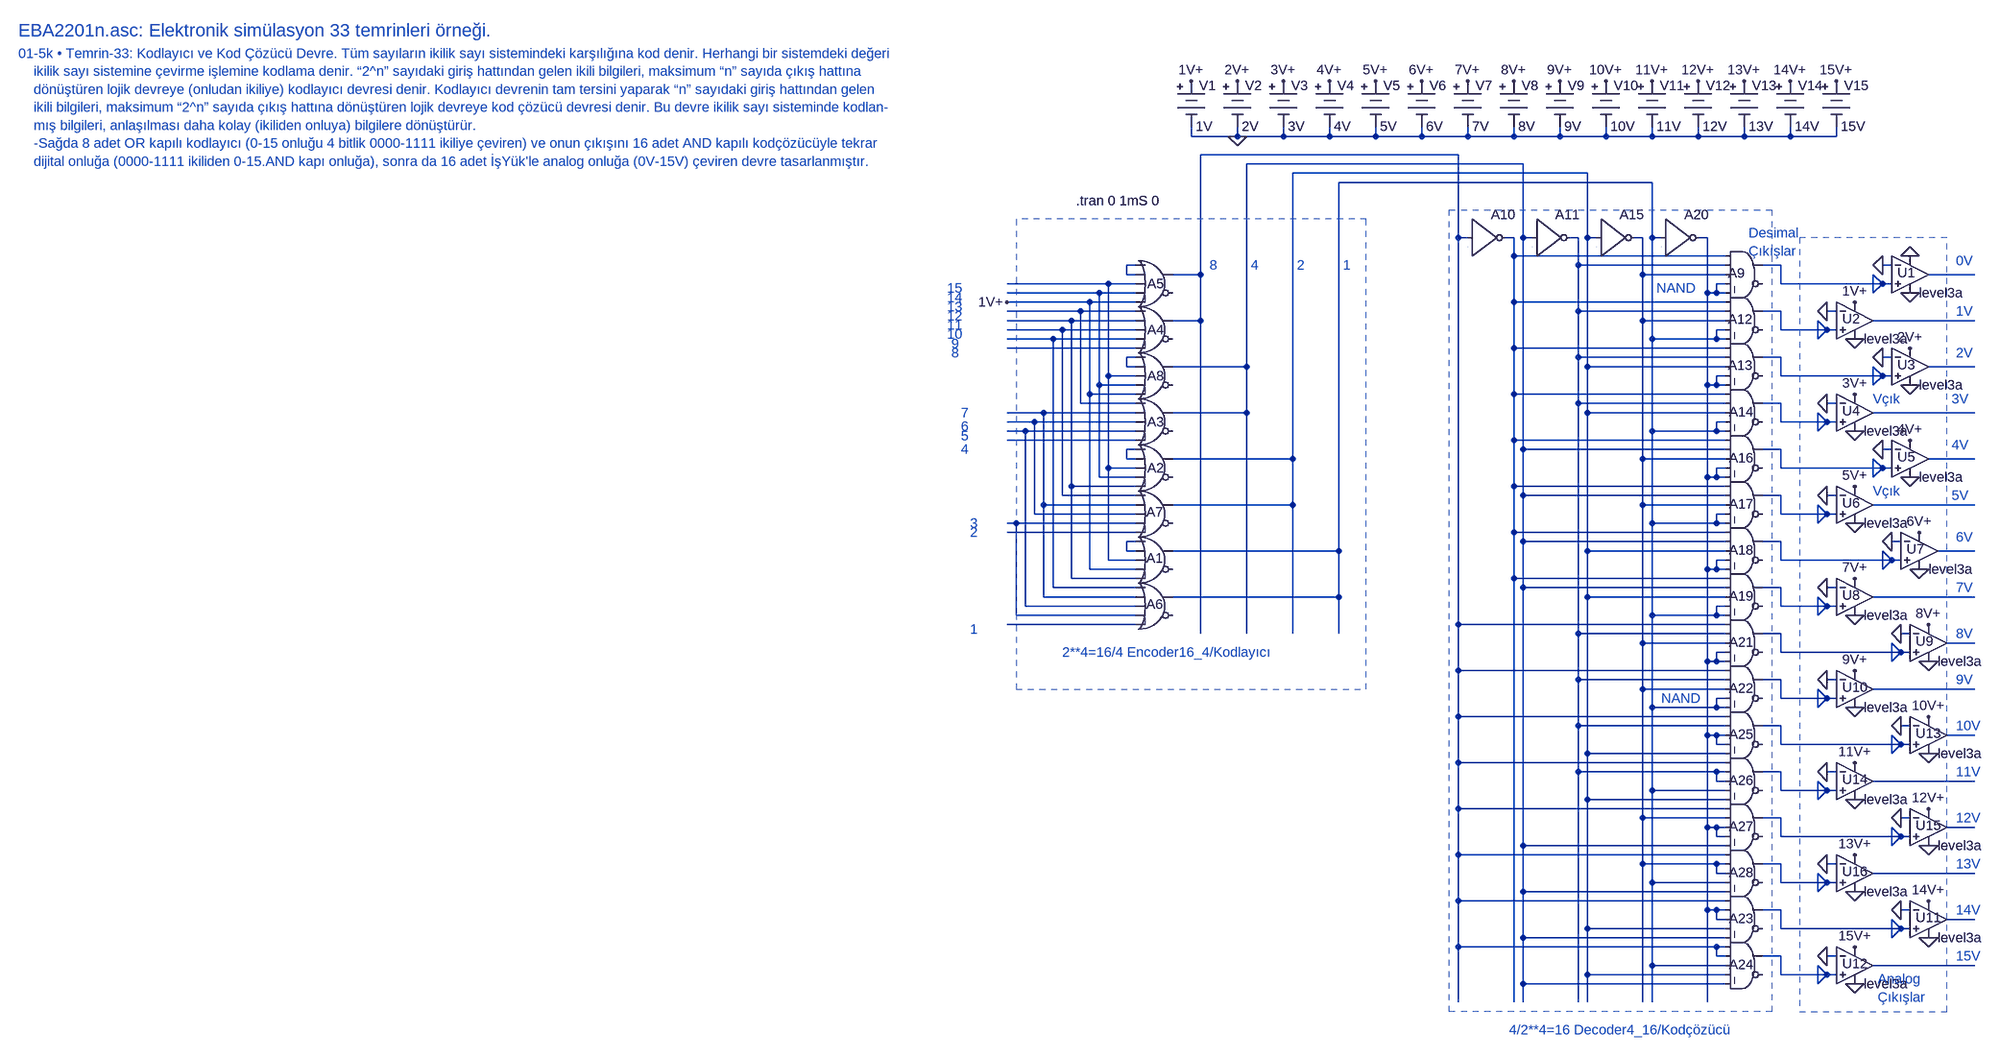
[diagram p0: schematic EBA2201n.asc]
EBA2201n.asc, the LTspice schematic file:
Version 4
SHEET 1 7064 4332
WIRE 2176 240 2176 224
WIRE 2256 240 2256 224
WIRE 2256 240 2176 240
WIRE 2336 240 2336 224
WIRE 2336 240 2256 240
WIRE 2416 240 2416 224
WIRE 2416 240 2336 240
WIRE 2496 240 2496 224
WIRE 2496 240 2416 240
WIRE 2576 240 2576 224
WIRE 2576 240 2496 240
WIRE 2656 240 2656 224
WIRE 2656 240 2576 240
WIRE 2736 240 2736 224
WIRE 2736 240 2656 240
WIRE 2816 240 2816 224
WIRE 2816 240 2736 240
WIRE 2896 240 2896 224
WIRE 2896 240 2816 240
WIRE 2976 240 2976 224
WIRE 2976 240 2896 240
WIRE 3056 240 3056 224
WIRE 3056 240 2976 240
WIRE 3136 240 3136 224
WIRE 3136 240 3056 240
WIRE 3216 240 3216 224
WIRE 3216 240 3136 240
WIRE 3296 240 3296 224
WIRE 3296 240 3216 240
WIRE 2640 272 2192 272
WIRE 2752 288 2272 288
WIRE 2864 304 2352 304
WIRE 2976 320 2432 320
WIRE 2640 416 2640 272
WIRE 2656 416 2640 416
WIRE 2736 416 2720 416
WIRE 2752 416 2752 288
WIRE 2768 416 2752 416
WIRE 2848 416 2832 416
WIRE 2864 416 2864 304
WIRE 2880 416 2864 416
WIRE 2960 416 2944 416
WIRE 2976 416 2976 320
WIRE 2992 416 2976 416
WIRE 3072 416 3056 416
WIRE 2736 448 2736 416
WIRE 3104 448 2736 448
WIRE 2080 464 2064 464
WIRE 2848 464 2848 416
WIRE 3104 464 2848 464
WIRE 3200 464 3168 464
WIRE 3392 464 3376 464
WIRE 2064 480 2064 464
WIRE 2080 480 2064 480
WIRE 2192 480 2192 272
WIRE 2192 480 2144 480
WIRE 2960 480 2960 416
WIRE 3104 480 2960 480
WIRE 3536 480 3456 480
WIRE 2032 496 1856 496
WIRE 2080 496 2032 496
WIRE 3104 496 3088 496
WIRE 3200 496 3200 464
WIRE 3376 496 3360 480
WIRE 3376 496 3200 496
WIRE 3392 496 3376 496
WIRE 2016 512 1856 512
WIRE 2080 512 2016 512
WIRE 3072 512 3072 416
WIRE 3088 512 3088 496
WIRE 3088 512 3072 512
WIRE 3104 512 3088 512
WIRE 3360 512 3360 480
WIRE 3360 512 3376 496
WIRE 2000 528 1856 528
WIRE 2080 528 2000 528
WIRE 2736 528 2736 448
WIRE 3104 528 2736 528
WIRE 1984 544 1856 544
WIRE 2080 544 1984 544
WIRE 2848 544 2848 464
WIRE 3104 544 2848 544
WIRE 3200 544 3168 544
WIRE 3296 544 3280 544
WIRE 1968 560 1856 560
WIRE 2080 560 1968 560
WIRE 2192 560 2192 480
WIRE 2192 560 2144 560
WIRE 2960 560 2960 480
WIRE 3104 560 2960 560
WIRE 3536 560 3360 560
WIRE 1952 576 1856 576
WIRE 2080 576 1952 576
WIRE 3104 576 3088 576
WIRE 3200 576 3200 544
WIRE 3280 576 3264 560
WIRE 3280 576 3200 576
WIRE 3296 576 3280 576
WIRE 1936 592 1856 592
WIRE 2080 592 1936 592
WIRE 2976 592 2976 416
WIRE 3088 592 3088 576
WIRE 3088 592 2976 592
WIRE 3104 592 3088 592
WIRE 3264 592 3264 560
WIRE 3264 592 3280 576
WIRE 2080 608 1856 608
WIRE 2736 608 2736 528
WIRE 3104 608 2736 608
WIRE 2080 624 2064 624
WIRE 2848 624 2848 544
WIRE 3104 624 2848 624
WIRE 3200 624 3168 624
WIRE 3392 624 3376 624
WIRE 2064 640 2064 624
WIRE 2080 640 2064 640
WIRE 2272 640 2272 288
WIRE 2272 640 2144 640
WIRE 2864 640 2864 416
WIRE 3104 640 2864 640
WIRE 3536 640 3456 640
WIRE 2032 656 2032 496
WIRE 2080 656 2032 656
WIRE 3104 656 3088 656
WIRE 3200 656 3200 624
WIRE 3376 656 3360 640
WIRE 3376 656 3200 656
WIRE 3392 656 3376 656
WIRE 2016 672 2016 512
WIRE 2080 672 2016 672
WIRE 3072 672 3072 512
WIRE 3088 672 3088 656
WIRE 3088 672 3072 672
WIRE 3104 672 3088 672
WIRE 3360 672 3360 640
WIRE 3360 672 3376 656
WIRE 2000 688 2000 528
WIRE 2080 688 2000 688
WIRE 2736 688 2736 608
WIRE 3104 688 2736 688
WIRE 1984 704 1984 544
WIRE 2080 704 1984 704
WIRE 2848 704 2848 624
WIRE 3104 704 2848 704
WIRE 3200 704 3168 704
WIRE 3296 704 3280 704
WIRE 1920 720 1856 720
WIRE 2080 720 1920 720
WIRE 2272 720 2272 640
WIRE 2272 720 2144 720
WIRE 2864 720 2864 640
WIRE 3104 720 2864 720
WIRE 3536 720 3360 720
WIRE 1904 736 1856 736
WIRE 2080 736 1904 736
WIRE 3104 736 3088 736
WIRE 3200 736 3200 704
WIRE 3280 736 3264 720
WIRE 3280 736 3200 736
WIRE 3296 736 3280 736
WIRE 1888 752 1856 752
WIRE 2080 752 1888 752
WIRE 2976 752 2976 592
WIRE 3088 752 3088 736
WIRE 3088 752 2976 752
WIRE 3104 752 3088 752
WIRE 3264 752 3264 720
WIRE 3264 752 3280 736
WIRE 2080 768 1856 768
WIRE 2736 768 2736 688
WIRE 3104 768 2736 768
WIRE 2080 784 2064 784
WIRE 2752 784 2752 416
WIRE 3104 784 2752 784
WIRE 3200 784 3168 784
WIRE 3392 784 3376 784
WIRE 2064 800 2064 784
WIRE 2080 800 2064 800
WIRE 2352 800 2352 304
WIRE 2352 800 2144 800
WIRE 2960 800 2960 560
WIRE 3104 800 2960 800
WIRE 3536 800 3456 800
WIRE 2032 816 2032 656
WIRE 2080 816 2032 816
WIRE 3104 816 3088 816
WIRE 3200 816 3200 784
WIRE 3376 816 3360 800
WIRE 3376 816 3200 816
WIRE 3392 816 3376 816
WIRE 2016 832 2016 672
WIRE 2080 832 2016 832
WIRE 3072 832 3072 672
WIRE 3088 832 3088 816
WIRE 3088 832 3072 832
WIRE 3104 832 3088 832
WIRE 3360 832 3360 800
WIRE 3360 832 3376 816
WIRE 1968 848 1968 560
WIRE 2080 848 1968 848
WIRE 2736 848 2736 768
WIRE 3104 848 2736 848
WIRE 1952 864 1952 576
WIRE 2080 864 1952 864
WIRE 2752 864 2752 784
WIRE 3104 864 2752 864
WIRE 3200 864 3168 864
WIRE 3296 864 3280 864
WIRE 1920 880 1920 720
WIRE 2080 880 1920 880
WIRE 2352 880 2352 800
WIRE 2352 880 2144 880
WIRE 2960 880 2960 800
WIRE 3104 880 2960 880
WIRE 3536 880 3360 880
WIRE 1904 896 1904 736
WIRE 2080 896 1904 896
WIRE 3104 896 3088 896
WIRE 3200 896 3200 864
WIRE 3280 896 3264 880
WIRE 3280 896 3200 896
WIRE 3296 896 3280 896
WIRE 1872 912 1856 912
WIRE 2080 912 1872 912
WIRE 2976 912 2976 752
WIRE 3088 912 3088 896
WIRE 3088 912 2976 912
WIRE 3104 912 3088 912
WIRE 3264 912 3264 880
WIRE 3264 912 3280 896
WIRE 2080 928 1856 928
WIRE 2736 928 2736 848
WIRE 3104 928 2736 928
WIRE 2080 944 2064 944
WIRE 2752 944 2752 864
WIRE 3104 944 2752 944
WIRE 3200 944 3168 944
WIRE 3408 944 3392 944
WIRE 2064 960 2064 944
WIRE 2080 960 2064 960
WIRE 2432 960 2432 320
WIRE 2432 960 2144 960
WIRE 2864 960 2864 720
WIRE 3104 960 2864 960
WIRE 3536 960 3472 960
WIRE 2032 976 2032 816
WIRE 2080 976 2032 976
WIRE 3104 976 3088 976
WIRE 3200 976 3200 944
WIRE 3392 976 3376 960
WIRE 3392 976 3200 976
WIRE 3408 976 3392 976
WIRE 2000 992 2000 688
WIRE 2080 992 2000 992
WIRE 3072 992 3072 832
WIRE 3088 992 3088 976
WIRE 3088 992 3072 992
WIRE 3104 992 3088 992
WIRE 3376 992 3376 960
WIRE 3376 992 3392 976
WIRE 1968 1008 1968 848
WIRE 2080 1008 1968 1008
WIRE 2736 1008 2736 928
WIRE 3104 1008 2736 1008
WIRE 1936 1024 1936 592
WIRE 2080 1024 1936 1024
WIRE 2752 1024 2752 944
WIRE 3104 1024 2752 1024
WIRE 3200 1024 3168 1024
WIRE 3296 1024 3280 1024
WIRE 1920 1040 1920 880
WIRE 2080 1040 1920 1040
WIRE 2432 1040 2432 960
WIRE 2432 1040 2144 1040
WIRE 2864 1040 2864 960
WIRE 3104 1040 2864 1040
WIRE 3536 1040 3360 1040
WIRE 1888 1056 1888 752
WIRE 2080 1056 1888 1056
WIRE 3104 1056 3088 1056
WIRE 3200 1056 3200 1024
WIRE 3280 1056 3264 1040
WIRE 3280 1056 3200 1056
WIRE 3296 1056 3280 1056
WIRE 1872 1072 1872 912
WIRE 2080 1072 1872 1072
WIRE 2976 1072 2976 912
WIRE 3088 1072 3088 1056
WIRE 3088 1072 2976 1072
WIRE 3104 1072 3088 1072
WIRE 3264 1072 3264 1040
WIRE 3264 1072 3280 1056
WIRE 2080 1088 1856 1088
WIRE 2640 1088 2640 416
WIRE 3104 1088 2640 1088
WIRE 2192 1104 2192 560
WIRE 2272 1104 2272 720
WIRE 2352 1104 2352 880
WIRE 2432 1104 2432 1040
WIRE 2848 1104 2848 704
WIRE 3104 1104 2848 1104
WIRE 3200 1104 3168 1104
WIRE 3424 1104 3408 1104
WIRE 2960 1120 2960 880
WIRE 3104 1120 2960 1120
WIRE 3536 1120 3488 1120
WIRE 3104 1136 3088 1136
WIRE 3200 1136 3200 1104
WIRE 3408 1136 3392 1120
WIRE 3408 1136 3200 1136
WIRE 3424 1136 3408 1136
WIRE 3072 1152 3072 992
WIRE 3088 1152 3088 1136
WIRE 3088 1152 3072 1152
WIRE 3104 1152 3088 1152
WIRE 3392 1152 3392 1120
WIRE 3392 1152 3408 1136
WIRE 2640 1168 2640 1088
WIRE 3104 1168 2640 1168
WIRE 2848 1184 2848 1104
WIRE 3104 1184 2848 1184
WIRE 3200 1184 3168 1184
WIRE 3296 1184 3280 1184
WIRE 2960 1200 2960 1120
WIRE 3104 1200 2960 1200
WIRE 3536 1200 3360 1200
WIRE 3104 1216 3088 1216
WIRE 3200 1216 3200 1184
WIRE 3280 1216 3264 1200
WIRE 3280 1216 3200 1216
WIRE 3296 1216 3280 1216
WIRE 2976 1232 2976 1072
WIRE 3088 1232 3088 1216
WIRE 3088 1232 2976 1232
WIRE 3104 1232 3088 1232
WIRE 3264 1232 3264 1200
WIRE 3264 1232 3280 1216
WIRE 2640 1248 2640 1168
WIRE 3104 1248 2640 1248
WIRE 2848 1264 2848 1184
WIRE 3104 1264 2848 1264
WIRE 3200 1264 3168 1264
WIRE 3424 1264 3408 1264
WIRE 3072 1280 3072 1152
WIRE 3088 1280 3072 1280
WIRE 3104 1280 3088 1280
WIRE 3536 1280 3488 1280
WIRE 3088 1296 3088 1280
WIRE 3104 1296 3088 1296
WIRE 3200 1296 3200 1264
WIRE 3408 1296 3392 1280
WIRE 3408 1296 3200 1296
WIRE 3424 1296 3408 1296
WIRE 2864 1312 2864 1040
WIRE 3104 1312 2864 1312
WIRE 3392 1312 3392 1280
WIRE 3392 1312 3408 1296
WIRE 2640 1328 2640 1248
WIRE 3104 1328 2640 1328
WIRE 2848 1344 2848 1264
WIRE 3088 1344 2848 1344
WIRE 3104 1344 3088 1344
WIRE 3200 1344 3168 1344
WIRE 3296 1344 3280 1344
WIRE 3088 1360 3088 1344
WIRE 3104 1360 3088 1360
WIRE 3536 1360 3360 1360
WIRE 2976 1376 2976 1232
WIRE 3104 1376 2976 1376
WIRE 3200 1376 3200 1344
WIRE 3280 1376 3264 1360
WIRE 3280 1376 3200 1376
WIRE 3296 1376 3280 1376
WIRE 2864 1392 2864 1312
WIRE 3104 1392 2864 1392
WIRE 3264 1392 3264 1360
WIRE 3264 1392 3280 1376
WIRE 2640 1408 2640 1328
WIRE 3104 1408 2640 1408
WIRE 2960 1424 2960 1200
WIRE 3104 1424 2960 1424
WIRE 3200 1424 3168 1424
WIRE 3424 1424 3408 1424
WIRE 3072 1440 3072 1280
WIRE 3088 1440 3072 1440
WIRE 3104 1440 3088 1440
WIRE 3536 1440 3488 1440
WIRE 3088 1456 3088 1440
WIRE 3104 1456 3088 1456
WIRE 3200 1456 3200 1424
WIRE 3408 1456 3392 1440
WIRE 3408 1456 3200 1456
WIRE 3424 1456 3408 1456
WIRE 2752 1472 2752 1024
WIRE 3104 1472 2752 1472
WIRE 3392 1472 3392 1440
WIRE 3392 1472 3408 1456
WIRE 2640 1488 2640 1408
WIRE 3104 1488 2640 1488
WIRE 2960 1504 2960 1424
WIRE 3088 1504 2960 1504
WIRE 3104 1504 3088 1504
WIRE 3200 1504 3168 1504
WIRE 3296 1504 3280 1504
WIRE 3088 1520 3088 1504
WIRE 3104 1520 3088 1520
WIRE 3536 1520 3360 1520
WIRE 2976 1536 2976 1376
WIRE 3104 1536 2976 1536
WIRE 3200 1536 3200 1504
WIRE 3280 1536 3264 1520
WIRE 3280 1536 3200 1536
WIRE 3296 1536 3280 1536
WIRE 2752 1552 2752 1472
WIRE 3104 1552 2752 1552
WIRE 3264 1552 3264 1520
WIRE 3264 1552 3280 1536
WIRE 2640 1568 2640 1488
WIRE 3104 1568 2640 1568
WIRE 3072 1584 3072 1440
WIRE 3088 1584 3072 1584
WIRE 3104 1584 3088 1584
WIRE 3200 1584 3168 1584
WIRE 3424 1584 3408 1584
WIRE 3088 1600 3088 1584
WIRE 3104 1600 3088 1600
WIRE 3536 1600 3488 1600
WIRE 2864 1616 2864 1392
WIRE 3104 1616 2864 1616
WIRE 3200 1616 3200 1584
WIRE 3408 1616 3392 1600
WIRE 3408 1616 3200 1616
WIRE 3424 1616 3408 1616
WIRE 2752 1632 2752 1552
WIRE 3104 1632 2752 1632
WIRE 3392 1632 3392 1600
WIRE 3392 1632 3408 1616
WIRE 2640 1648 2640 1568
WIRE 3088 1648 2640 1648
WIRE 3104 1648 3088 1648
WIRE 3088 1664 3088 1648
WIRE 3104 1664 3088 1664
WIRE 3200 1664 3168 1664
WIRE 3296 1664 3280 1664
WIRE 2976 1680 2976 1536
WIRE 3104 1680 2976 1680
WIRE 3536 1680 3360 1680
WIRE 2864 1696 2864 1616
WIRE 3104 1696 2864 1696
WIRE 3200 1696 3200 1664
WIRE 3280 1696 3264 1680
WIRE 3280 1696 3200 1696
WIRE 3296 1696 3280 1696
WIRE 2752 1712 2752 1632
WIRE 3104 1712 2752 1712
WIRE 3264 1712 3264 1680
WIRE 3264 1712 3280 1696
WIRE 2640 1744 2640 1648
WIRE 2736 1744 2736 1008
WIRE 2752 1744 2752 1712
WIRE 2848 1744 2848 1344
WIRE 2864 1744 2864 1696
WIRE 2960 1744 2960 1504
WIRE 2976 1744 2976 1680
WIRE 3072 1744 3072 1584
FLAG 2256 240 0
FLAG 2176 144 1V+
FLAG 1856 528 1V+
FLAG 3376 464 0
FLAG 3424 512 0
FLAG 3280 544 0
FLAG 3328 592 0
FLAG 3376 624 0
FLAG 3424 672 0
FLAG 3280 704 0
FLAG 3328 752 0
FLAG 3376 784 0
FLAG 3424 832 0
FLAG 3280 864 0
FLAG 3328 912 0
FLAG 3392 944 0
FLAG 3440 992 0
FLAG 3280 1024 0
FLAG 3328 1072 0
FLAG 3408 1104 0
FLAG 3456 1152 0
FLAG 3280 1184 0
FLAG 3328 1232 0
FLAG 3424 448 0
FLAG 3408 1584 0
FLAG 3456 1632 0
FLAG 3280 1664 0
FLAG 3328 1712 0
FLAG 3408 1264 0
FLAG 3456 1312 0
FLAG 3280 1344 0
FLAG 3328 1392 0
FLAG 3408 1424 0
FLAG 3456 1472 0
FLAG 3280 1504 0
FLAG 3328 1552 0
FLAG 2256 144 2V+
FLAG 2336 144 3V+
FLAG 2416 144 4V+
FLAG 2496 144 5V+
FLAG 2576 144 6V+
FLAG 2656 144 7V+
FLAG 2736 144 8V+
FLAG 2816 144 9V+
FLAG 2896 144 10V+
FLAG 2976 144 11V+
FLAG 3056 144 12V+
FLAG 3136 144 13V+
FLAG 3216 144 14V+
FLAG 3296 144 15V+
FLAG 3328 528 1V+
FLAG 3424 608 2V+
FLAG 3328 688 3V+
FLAG 3424 768 4V+
FLAG 3328 848 5V+
FLAG 3440 928 6V+
FLAG 3328 1008 7V+
FLAG 3456 1088 8V+
FLAG 3328 1168 9V+
FLAG 3456 1248 10V+
FLAG 3328 1328 11V+
FLAG 3456 1408 12V+
FLAG 3328 1488 13V+
FLAG 3456 1568 14V+
FLAG 3328 1648 15V+
SYMBOL Misc\\battery 2176 128 R0
WINDOW 3 8 95 Left 2
WINDOW 0 14 24 Left 2
SYMATTR Value 1V
SYMATTR InstName V1
SYMBOL Digital\\or 2112 912 R0
WINDOW 0 -14 61 Left 2
SYMATTR InstName A1
SYMBOL Digital\\or 2112 752 R0
WINDOW 0 -12 64 Left 2
SYMATTR InstName A2
SYMBOL Digital\\or 2112 672 R0
WINDOW 0 -12 64 Left 2
SYMATTR InstName A3
SYMBOL Digital\\or 2112 512 R0
WINDOW 0 -12 64 Left 2
SYMATTR InstName A4
SYMBOL Digital\\or 2112 432 R0
WINDOW 0 -12 64 Left 2
SYMATTR InstName A5
SYMBOL Digital\\or 2112 992 R0
WINDOW 0 -14 61 Left 2
SYMATTR InstName A6
SYMBOL Digital\\or 2112 832 R0
WINDOW 0 -14 61 Left 2
SYMATTR InstName A7
SYMBOL Digital\\or 2112 592 R0
WINDOW 0 -12 64 Left 2
SYMATTR InstName A8
SYMBOL Digital\\and 3136 416 R0
WINDOW 0 -28 62 Left 2
SYMATTR InstName A9
SYMBOL Digital\\inv 2656 352 R0
SYMATTR InstName A10
SYMBOL Digital\\inv 2768 352 R0
SYMATTR InstName A11
SYMBOL Digital\\and 3136 496 R0
WINDOW 0 -28 62 Left 2
SYMATTR InstName A12
SYMBOL Digital\\and 3136 576 R0
WINDOW 0 -28 62 Left 2
SYMATTR InstName A13
SYMBOL Digital\\and 3136 656 R0
WINDOW 0 -26 63 Left 2
SYMATTR InstName A14
SYMBOL OpAmps\\UniversalOpAmp3 3424 480 R0
WINDOW 0 -22 -3 Left 2
SYMATTR InstName U1
SYMBOL Digital\\inv 2880 352 R0
SYMATTR InstName A15
SYMBOL Digital\\and 3136 736 R0
WINDOW 0 -26 63 Left 2
SYMATTR InstName A16
SYMBOL Digital\\and 3136 816 R0
WINDOW 0 -26 63 Left 2
SYMATTR InstName A17
SYMBOL Digital\\and 3136 896 R0
WINDOW 0 -26 63 Left 2
SYMATTR InstName A18
SYMBOL Digital\\and 3136 976 R0
WINDOW 0 -26 63 Left 2
SYMATTR InstName A19
SYMBOL Digital\\inv 2992 352 R0
SYMATTR InstName A20
SYMBOL Digital\\and 3136 1056 R0
WINDOW 0 -26 63 Left 2
SYMATTR InstName A21
SYMBOL Digital\\and 3136 1136 R0
WINDOW 0 -26 63 Left 2
SYMATTR InstName A22
SYMBOL OpAmps\\UniversalOpAmp3 3328 560 R0
WINDOW 0 -22 -3 Left 2
SYMATTR InstName U2
SYMBOL OpAmps\\UniversalOpAmp3 3424 640 R0
WINDOW 0 -22 -3 Left 2
SYMATTR InstName U3
SYMBOL OpAmps\\UniversalOpAmp3 3328 720 R0
WINDOW 0 -22 -3 Left 2
SYMATTR InstName U4
SYMBOL OpAmps\\UniversalOpAmp3 3424 800 R0
WINDOW 0 -22 -3 Left 2
SYMATTR InstName U5
SYMBOL OpAmps\\UniversalOpAmp3 3328 880 R0
WINDOW 0 -22 -3 Left 2
SYMATTR InstName U6
SYMBOL OpAmps\\UniversalOpAmp3 3440 960 R0
WINDOW 0 -22 -3 Left 2
SYMATTR InstName U7
SYMBOL OpAmps\\UniversalOpAmp3 3328 1040 R0
WINDOW 0 -22 -3 Left 2
SYMATTR InstName U8
SYMBOL OpAmps\\UniversalOpAmp3 3456 1120 R0
WINDOW 0 -22 -3 Left 2
SYMATTR InstName U9
SYMBOL OpAmps\\UniversalOpAmp3 3328 1200 R0
WINDOW 0 -22 -3 Left 2
SYMATTR InstName U10
SYMBOL Digital\\and 3136 1536 R0
WINDOW 0 -26 63 Left 2
SYMATTR InstName A23
SYMBOL Digital\\and 3136 1616 R0
WINDOW 0 -26 63 Left 2
SYMATTR InstName A24
SYMBOL OpAmps\\UniversalOpAmp3 3456 1600 R0
WINDOW 0 -22 -3 Left 2
SYMATTR InstName U11
SYMBOL OpAmps\\UniversalOpAmp3 3328 1680 R0
WINDOW 0 -22 -3 Left 2
SYMATTR InstName U12
SYMBOL Digital\\and 3136 1216 R0
WINDOW 0 -26 63 Left 2
SYMATTR InstName A25
SYMBOL Digital\\and 3136 1296 R0
WINDOW 0 -26 63 Left 2
SYMATTR InstName A26
SYMBOL OpAmps\\UniversalOpAmp3 3456 1280 R0
WINDOW 0 -22 -3 Left 2
SYMATTR InstName U13
SYMBOL OpAmps\\UniversalOpAmp3 3328 1360 R0
WINDOW 0 -22 -3 Left 2
SYMATTR InstName U14
SYMBOL Digital\\and 3136 1376 R0
WINDOW 0 -26 63 Left 2
SYMATTR InstName A27
SYMBOL Digital\\and 3136 1456 R0
WINDOW 0 -26 63 Left 2
SYMATTR InstName A28
SYMBOL OpAmps\\UniversalOpAmp3 3456 1440 R0
WINDOW 0 -22 -3 Left 2
SYMATTR InstName U15
SYMBOL OpAmps\\UniversalOpAmp3 3328 1520 R0
WINDOW 0 -22 -3 Left 2
SYMATTR InstName U16
SYMBOL Misc\\battery 2256 128 R0
WINDOW 3 8 95 Left 2
WINDOW 0 14 24 Left 2
SYMATTR Value 2V
SYMATTR InstName V2
SYMBOL Misc\\battery 2336 128 R0
WINDOW 3 8 95 Left 2
WINDOW 0 14 24 Left 2
SYMATTR Value 3V
SYMATTR InstName V3
SYMBOL Misc\\battery 2416 128 R0
WINDOW 3 8 95 Left 2
WINDOW 0 14 24 Left 2
SYMATTR Value 4V
SYMATTR InstName V4
SYMBOL Misc\\battery 2496 128 R0
WINDOW 3 8 95 Left 2
WINDOW 0 14 24 Left 2
SYMATTR Value 5V
SYMATTR InstName V5
SYMBOL Misc\\battery 2576 128 R0
WINDOW 3 8 95 Left 2
WINDOW 0 14 24 Left 2
SYMATTR Value 6V
SYMATTR InstName V6
SYMBOL Misc\\battery 2656 128 R0
WINDOW 3 8 95 Left 2
WINDOW 0 14 24 Left 2
SYMATTR Value 7V
SYMATTR InstName V7
SYMBOL Misc\\battery 2736 128 R0
WINDOW 3 8 95 Left 2
WINDOW 0 14 24 Left 2
SYMATTR Value 8V
SYMATTR InstName V8
SYMBOL Misc\\battery 2816 128 R0
WINDOW 3 8 95 Left 2
WINDOW 0 14 24 Left 2
SYMATTR Value 9V
SYMATTR InstName V9
SYMBOL Misc\\battery 2896 128 R0
WINDOW 3 8 95 Left 2
WINDOW 0 14 24 Left 2
SYMATTR Value 10V
SYMATTR InstName V10
SYMBOL Misc\\battery 2976 128 R0
WINDOW 3 8 95 Left 2
WINDOW 0 14 24 Left 2
SYMATTR Value 11V
SYMATTR InstName V11
SYMBOL Misc\\battery 3056 128 R0
WINDOW 3 8 95 Left 2
WINDOW 0 14 24 Left 2
SYMATTR Value 12V
SYMATTR InstName V12
SYMBOL Misc\\battery 3136 128 R0
WINDOW 3 8 95 Left 2
WINDOW 0 14 24 Left 2
SYMATTR Value 13V
SYMATTR InstName V13
SYMBOL Misc\\battery 3216 128 R0
WINDOW 3 8 95 Left 2
WINDOW 0 14 24 Left 2
SYMATTR Value 14V
SYMATTR InstName V14
SYMBOL Misc\\battery 3296 128 R0
WINDOW 3 8 95 Left 2
WINDOW 0 14 24 Left 2
SYMATTR Value 15V
SYMATTR InstName V15
TEXT -232 56 Left 3 ;EBA2201n.asc: Elektronik simülasyon 33 temrinleri örneği.
TEXT -232 96 Left 2 ;01-5k • Temrin-33: Kodlayıcı ve Kod Çözücü Devre. Tüm sayıların ikilik sayı sistemindeki karşılığına kod denir. Herhangi bir sistemdeki değeri\n    ikilik sayı sistemine çevirme işlemine kodlama denir. “2^n” sayıdaki giriş hattından gelen ikili bilgileri, maksimum “n” sayıda çıkış hattına \n    dönüştüren lojik devreye (onludan ikiliye) kodlayıcı devresi denir. Kodlayıcı devrenin tam tersini yaparak “n” sayıdaki giriş hattından gelen \n    ikili bilgileri, maksimum “2^n” sayıda çıkış hattına dönüştüren lojik devreye kod çözücü devresi denir. Bu devre ikilik sayı sisteminde kodlan-\n    mış bilgileri, anlaşılması daha kolay (ikiliden onluya) bilgilere dönüştürür.\n    -Sağda 8 adet OR kapılı kodlayıcı (0-15 onluğu 4 bitlik 0000-1111 ikiliye çeviren) ve onun çıkışını 16 adet AND kapılı kodçözücüyle tekrar \n    dijital onluğa (0000-1111 ikiliden 0-15.AND kapı onluğa), sonra da 16 adet İşYük'le analog onluğa (0V-15V) çeviren devre tasarlanmıştır.
TEXT 1976 352 Left 2 !.tran 0 1mS 0
TEXT 2440 464 Left 2 ;1
TEXT 2360 464 Left 2 ;2
TEXT 2280 464 Left 2 ;4
TEXT 2208 464 Left 2 ;8
TEXT 1792 1096 Left 2 ;1
TEXT 1792 928 Left 2 ;2
TEXT 1776 784 Left 2 ;4
TEXT 1760 616 Left 2 ;8
TEXT 1792 912 Left 2 ;3
TEXT 1776 760 Left 2 ;5
TEXT 1776 744 Left 2 ;6
TEXT 1776 720 Left 2 ;7
TEXT 1760 600 Left 2 ;9
TEXT 1752 584 Left 2 ;10
TEXT 1752 568 Left 2 ;11
TEXT 1752 552 Left 2 ;12
TEXT 1752 536 Left 2 ;13
TEXT 1752 520 Left 2 ;14
TEXT 1752 504 Left 2 ;15
TEXT 2728 1792 Left 2 ;4/2**4=16 Decoder4_16/Kodçözücü
TEXT 2984 504 Left 2 ;NAND
TEXT 3360 696 Left 2 ;Vçık
TEXT 3360 856 Left 2 ;Vçık
TEXT 2992 1216 Left 2 ;NAND
TEXT 3504 456 Left 2 ;0V
TEXT 3504 544 Left 2 ;1V
TEXT 3504 616 Left 2 ;2V
TEXT 3496 696 Left 2 ;3V
TEXT 3496 776 Left 2 ;4V
TEXT 3496 864 Left 2 ;5V
TEXT 3504 936 Left 2 ;6V
TEXT 3504 1024 Left 2 ;7V
TEXT 3504 1104 Left 2 ;8V
TEXT 3504 1184 Left 2 ;9V
TEXT 3368 1704 Left 2 ;Analog\nÇıkışlar
TEXT 3144 408 Left 2 ;Desimal\nÇıkışlar
TEXT 3504 1584 Left 2 ;14V
TEXT 3504 1664 Left 2 ;15V
TEXT 3504 1264 Left 2 ;10V
TEXT 3504 1344 Left 2 ;11V
TEXT 3504 1424 Left 2 ;12V
TEXT 3504 1504 Left 2 ;13V
TEXT 1952 1136 Left 2 ;2**4=16/4 Encoder16_4/Kodlayıcı
RECTANGLE Normal 3184 1760 2624 368 2
RECTANGLE Normal 1872 1200 2480 384 2
RECTANGLE Normal 3488 416 3232 1760 2

The netlist it stands for:
* EBA2201n.asc
V1 1V+ 0 1V
A1 N037 N037 N012 1V+ N016 0 N004 0 OR
A2 N030 N030 N012 N013 N016 0 N003 0 OR
A3 N014 N025 N027 N028 N029 0 N002 0 OR
A4 N014 N016 N018 N019 N020 0 N001 0 OR
A5 N009 N009 N012 N013 1V+ 0 N001 0 OR
A6 N019 N025 N028 N035 N042 0 N004 0 OR
A7 N018 N025 N027 N035 N036 0 N003 0 OR
A8 N021 N021 N012 N013 1V+ 0 N002 0 OR
A9 N005 N006 N007 N008 N008 0 N010 0 AND
A10 N001 0 0 0 0 N005 0 0 BUF
A11 N002 0 0 0 0 N006 0 0 BUF
A12 N005 N006 N007 N004 N004 0 N015 0 AND
A13 N005 N006 N003 N008 N008 0 N022 0 AND
A14 N005 N006 N003 N004 N004 0 N024 0 AND
XU1 N010 0 0 0 N011 level3a  ; pins In+ In- V+ V- OUT
A15 N003 0 0 0 0 N007 0 0 BUF
A16 N005 N002 N007 N008 N008 0 N031 0 AND
A17 N005 N002 N007 N004 N004 0 N033 0 AND
A18 N005 N002 N003 N008 N008 0 N038 0 AND
A19 N005 N002 N003 N004 N004 0 N040 0 AND
A20 N004 0 0 0 0 N008 0 0 BUF
A21 N001 N006 N007 N008 N008 0 N043 0 AND
A22 N001 N006 N007 N004 N004 0 N045 0 AND
XU2 N015 0 1V+ 0 N017 level3a  ; pins In+ In- V+ V- OUT
XU3 N022 0 2V+ 0 N023 level3a  ; pins In+ In- V+ V- OUT
XU4 N024 0 3V+ 0 N026 level3a  ; pins In+ In- V+ V- OUT
XU5 N031 0 4V+ 0 N032 level3a  ; pins In+ In- V+ V- OUT
XU6 N033 0 5V+ 0 N034 level3a  ; pins In+ In- V+ V- OUT
XU7 N038 0 6V+ 0 N039 level3a  ; pins In+ In- V+ V- OUT
XU8 N040 0 7V+ 0 N041 level3a  ; pins In+ In- V+ V- OUT
XU9 N043 0 8V+ 0 N044 level3a  ; pins In+ In- V+ V- OUT
XU10 N045 0 9V+ 0 N046 level3a  ; pins In+ In- V+ V- OUT
A23 N001 N008 N008 N003 N002 0 N055 0 AND
A24 N001 N001 N004 N003 N002 0 N057 0 AND
XU11 N055 0 14V+ 0 N056 level3a  ; pins In+ In- V+ V- OUT
XU12 N057 0 15V+ 0 N058 level3a  ; pins In+ In- V+ V- OUT
A25 N001 N006 N008 N008 N003 0 N047 0 AND
A26 N001 N006 N006 N004 N003 0 N049 0 AND
XU13 N047 0 10V+ 0 N048 level3a  ; pins In+ In- V+ V- OUT
XU14 N049 0 11V+ 0 N050 level3a  ; pins In+ In- V+ V- OUT
A27 N001 N007 N008 N008 N002 0 N051 0 AND
A28 N001 N007 N007 N004 N002 0 N053 0 AND
XU15 N051 0 12V+ 0 N052 level3a  ; pins In+ In- V+ V- OUT
XU16 N053 0 13V+ 0 N054 level3a  ; pins In+ In- V+ V- OUT
V2 2V+ 0 2V
V3 3V+ 0 3V
V4 4V+ 0 4V
V5 5V+ 0 5V
V6 6V+ 0 6V
V7 7V+ 0 7V
V8 8V+ 0 8V
V9 9V+ 0 9V
V10 10V+ 0 10V
V11 11V+ 0 11V
V12 12V+ 0 12V
V13 13V+ 0 13V
V14 14V+ 0 14V
V15 15V+ 0 15V
* EBA2201n.asc: Elektronik simülasyon 33 temrinleri örneği.
* 01-5k • Temrin-33: Kodlayıcı ve Kod Çözücü Devre. Tüm sayıların ikilik sayı sistemindeki karşılığına kod denir. Herhangi bir sistemdeki değeri
*     ikilik sayı sistemine çevirme işlemine kodlama denir. “2^n” sayıdaki giriş hattından gelen ikili bilgileri, maksimum “n” sayıda çıkış hattına
*     dönüştüren lojik devreye (onludan ikiliye) kodlayıcı devresi denir. Kodlayıcı devrenin tam tersini yaparak “n” sayıdaki giriş hattından gelen
*     ikili bilgileri, maksimum “2^n” sayıda çıkış hattına dönüştüren lojik devreye kod çözücü devresi denir. Bu devre ikilik sayı sisteminde kodlan-
*     mış bilgileri, anlaşılması daha kolay (ikiliden onluya) bilgilere dönüştürür.
*     -Sağda 8 adet OR kapılı kodlayıcı (0-15 onluğu 4 bitlik 0000-1111 ikiliye çeviren) ve onun çıkışını 16 adet AND kapılı kodçözücüyle tekrar
*     dijital onluğa (0000-1111 ikiliden 0-15.AND kapı onluğa), sonra da 16 adet İşYük'le analog onluğa (0V-15V) çeviren devre tasarlanmıştır.
.tran 0 1mS 0
* 1
* 2
* 4
* 8
* 1
* 2
* 4
* 8
* 3
* 5
* 6
* 7
* 9
* 10
* 11
* 12
* 13
* 14
* 15
* 4/2**4=16 Decoder4_16/Kodçözücü
* NAND
* Vçık
* Vçık
* NAND
* 0V
* 1V
* 2V
* 3V
* 4V
* 5V
* 6V
* 7V
* 8V
* 9V
* Analog
* Çıkışlar
* Desimal
* Çıkışlar
* 14V
* 15V
* 10V
* 11V
* 12V
* 13V
* 2**4=16/4 Encoder16_4/Kodlayıcı
.backanno
.end